# Altium schematic sheet micron_P3.SchDoc
size A; SheetNumber: 3; SheetTotal: 11
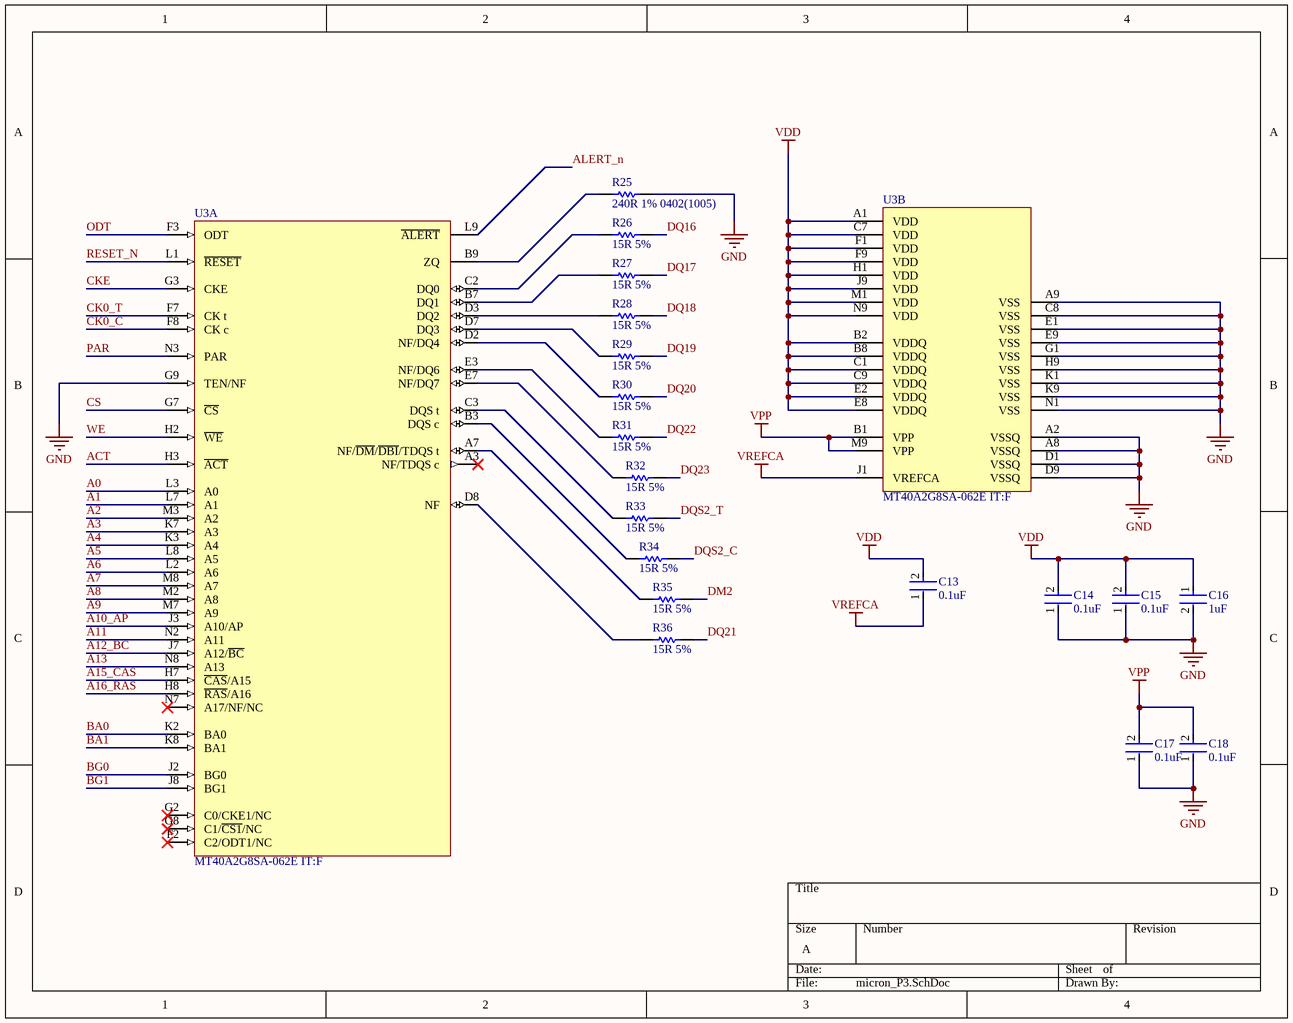
[diagram p0: micron_P3.SchDoc]

## Parts
C13  0.1uF  [FP-GRM15-MFG]
C14  0.1uF  [FP-GRM15-MFG]
C15  0.1uF  [FP-GRM15-MFG]
C16  1uF  [FP-CL511-IPC_C]
C17  0.1uF  [FP-GRM15-MFG]
C18  0.1uF  [FP-GRM15-MFG]
R25  240R 1% 0402(1005)  [RESC0402(1005)_L]
R26  15R 5%  [RESC1005X40X25LL05T10]
R27  15R 5%  [RESC1005X40X25LL05T10]
R28  15R 5%  [RESC1005X40X25LL05T10]
R29  15R 5%  [RESC1005X40X25LL05T10]
R30  15R 5%  [RESC1005X40X25LL05T10]
R31  15R 5%  [RESC1005X40X25LL05T10]
R32  15R 5%  [RESC1005X40X25LL05T10]
R33  15R 5%  [RESC1005X40X25LL05T10]
R34  15R 5%  [RESC1005X40X25LL05T10]
R35  15R 5%  [RESC1005X40X25LL05T10]
R36  15R 5%  [RESC1005X40X25LL05T10]
U3  MT40A2G8SA-062E IT:F  [SA_MFG]  (parts A,B of 2)

## Nets
GND: C14.1 C15.1 C16.2 C17.1 C18.1 R25.2 U3.A2(VSSQ) U3.A8(VSSQ) U3.A9(VSS) U3.C8(VSS) U3.D1(VSSQ) U3.D9(VSSQ) U3.E1(VSS) U3.E9(VSS) U3.G1(VSS) U3.G9(TEN/NF) U3.H9(VSS) U3.K1(VSS) U3.K9(VSS) U3.N1(VSS)
VDD: C13.2 C14.2 C15.2 C16.1 U3.A1(VDD) U3.B2(VDDQ) U3.B8(VDDQ) U3.C1(VDDQ) U3.C7(VDD) U3.C9(VDDQ) U3.E2(VDDQ) U3.E8(VDDQ) U3.F1(VDD) U3.F9(VDD) U3.H1(VDD) U3.J9(VDD) U3.M1(VDD) U3.N9(VDD)
VPP: C17.2 C18.2 U3.B1(VPP) U3.M9(VPP)
VREFCA: C13.1 U3.J1(VREFCA)
A0: U3.L3(A0)
A1: U3.L7(A1)
A2: U3.M3(A2)
A3: U3.K7(A3)
A4: U3.K3(A4)
A5: U3.L8(A5)
A6: U3.L2(A6)
A7: U3.M8(A7)
A8: U3.M2(A8)
A9: U3.M7(A9)
A10_AP: U3.J3(A10/AP)
A11: U3.N2(A11)
A12_BC: U3.J7(A12/~{BC})
A13: U3.N8(A13)
A15_CAS: U3.H7(~{CAS}/A15)
A16_RAS: U3.H8(~{RAS}/A16)
ACT: U3.H3(~{ACT})
ALERT_n: U3.L9(~{ALERT})
BA0: U3.K2(BA0)
BA1: U3.K8(BA1)
BG0: U3.J2(BG0)
BG1: U3.J8(BG1)
CK0_C: U3.F8(CK_c)
CK0_T: U3.F7(CK_t)
CKE: U3.G3(CKE)
CS: U3.G7(~{CS})
DM2: R35.2
DQ16: R26.2
DQ17: R27.2
DQ18: R28.2
DQ19: R29.2
DQ20: R30.2
DQ21: R36.2
DQ22: R31.2
DQ23: R32.2
DQS2_C: R34.2
DQS2_T: R33.2
ODT: U3.F3(ODT)
PAR: U3.N3(PAR)
RESET_N: U3.L1(~{RESET})
WE: U3.H2(~{WE})
NetR25_1: R25.1 U3.B9(ZQ)
NetR26_1: R26.1 U3.C2(DQ0)
NetR27_1: R27.1 U3.B7(DQ1)
NetR28_1: R28.1 U3.D3(DQ2)
NetR29_1: R29.1 U3.D7(DQ3)
NetR30_1: R30.1 U3.D2(NF/DQ4)
NetR31_1: R31.1 U3.E3(NF/DQ6)
NetR32_1: R32.1 U3.E7(NF/DQ7)
NetR33_1: R33.1 U3.C3(DQS_t)
NetR34_1: R34.1 U3.B3(DQS_c)
NetR35_1: R35.1 U3.A7(NF/~{DM}/~{DBI}/TDQS_t)
NetR36_1: R36.1 U3.D8(NF)

Not connected (* = marked no-connect by the designer): U3 A3(NF/TDQS_c)* F2(C2/ODT1/NC)* G2(C0/CKE1/NC)* G8(C1/~{CS1}/NC)* N7(A17/NF/NC)*

## Library data of the parts
C13-C15 C17 C18 = CMP-2100-03641-2: CAP CER 0.1UF 16V X7R 0402; Manufacturer Part Number: GRM155R71C104KA88D; Manufacturer: Murata; Standoff Height: 0mm; Tolerance: 10%; Voltage Rating: 16Vdc; Material: Ceramic; Capacitance: 0.10μF; Value: 0.10μF; RoHS: TRUE; Temperature Characteristic: X7R; Octopart: https://octopart.com/grm155r71c104ka88d-murata-196880; Digikey Description: CAP CER 0.1UF 16V X7R 0402; Device Class L3: Ceramic Capacitors; Height: 0.55mm; ComponentLink2Description: Datasheet; Temperature Range Low: -55°C; Ipc Land Pattern Name: CAPC10050X219; ComponentLink2URL: https://search.murata.co.jp/Ceramy/image/img/A01X/G101/ENG/GRM155R71H471KA01-01A.pdf; Device Class L1: Passive Components; Lead Free: yes; Category: Cap; Package: GRM15; Temperature: -55°C to +125°C; Device Class L2: Capacitors; Temperature Range High: +125°C; Mouser Description: 0402 0.1 uF 16V ±10 % Tolerance X7R SMT Multilayer Ceramic Capacitor
C16 = CMP-13271-001936-1: Cap Ceramic 1uF 10V X5R ±10% SMD 0402 +85°C Paper T/R; Depth: 0.5mm; Case Code (Imperial): 0402; Material: Ceramic; Mount: Surface Mount; Thickness: 0.022inch; Dielectric: X5R; Capacitance: 1uF; Radiation Hardening: No; Case/Package: 0402; Length: 1mm; Tolerance: 10%; Max Operating Temperature: 85°C; Package Quantity: 1; Width: 0.02inch; Voltage Rating: 10V; Contact Plating: Tin; Height: 0.5mm; Min Operating Temperature: -55°C; Case Code (Metric): 1005; Packaging: Tape and Reel
R25 = CMP-1011-00438-1: 240R 0.063W 1% 0402 (1005 Metric)  SMD; Case-Metric: 1005; Case-EIA: 0402; Value: 240.00 Ohm; Power: 0.063 W; Tolerance: 1 %; Technology: SMT
R26-R36 = CMP-2002-07413-1: Manufacturer: Yageo / Phycomp; Part Number: RC0402FR-0715RL
U3 = CMP-00526-125391410-1: DRAMChip DDR4 SDRAM 16Gbit 2Gx8 1.2V 78-Pin FBGA Tray; ComponentLink1URL: http://www.micron.com/; ComponentLink3Description: Manufacturer's Package Drawing; ComponentLink2Description: Datasheet URL; ComponentLink1Description: Manufacturer's Website; ComponentLink3URL: https://www.micron.com/content/dam/micron/global/public/products/customer-service-note/csn33-bga-user-guide.pdf; HelpURL: https://4donline.ihs.com/images/VipMasterIC/IC/MICT/MICT-S-A0014105731/MICT-S-A0014105731-1.pdf?hkey=6D3A4C79FDBF58556ACFDE234799DDF0; ComponentLink2URL: https://4donline.ihs.com/images/VipMasterIC/IC/MICT/MICT-S-A0014105731/MICT-S-A0014105731-1.pdf?hkey=6D3A4C79FDBF58556ACFDE234799DDF0